# Altium project EX1.PrjPcb
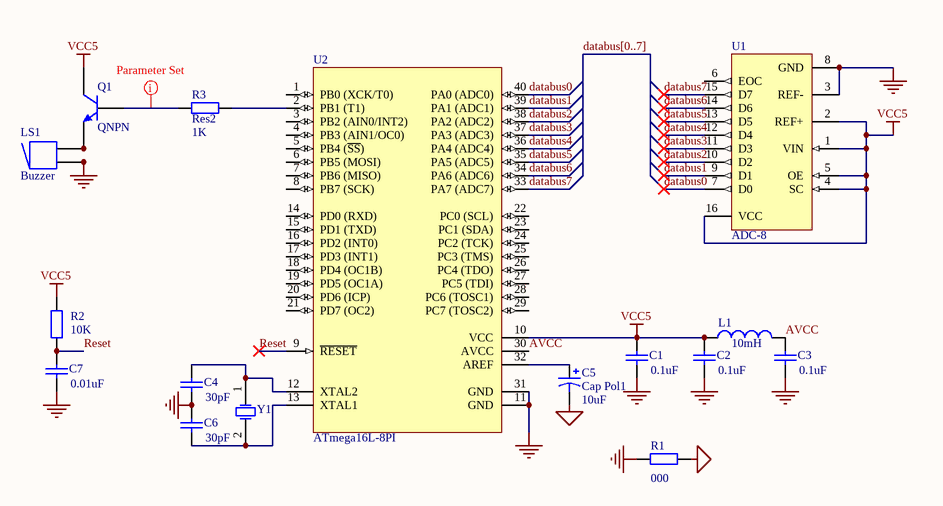
[diagram p0: EX1.SchDoc]
1 sheet, 16 parts. Net scope: global (net labels, ports and power ports of the same name join across sheets).
Board file: EX1.PcbDoc

## Sheet EX1.SchDoc: ex1
size A4; DocumentNumber: 1

### Parts
C1  value 0.1uF  [C0805]  (hidden comment: Cap)
C2  value 0.1uF  [C0805]  (hidden comment: Cap)
C3  value 0.1uF  [C0805]  (hidden comment: Cap)
C4  value 30pF  [C0805]  (hidden comment: Cap)
C5  Cap Pol1  value 10uF  [RB7.6-15]
C6  value 30pF  [C0805]  (hidden comment: Cap)
C7  value 0.01uF  [C0805]  (hidden comment: Cap)
L1  value 10mH  [C0805]  (hidden comment: Inductor)
LS1  Buzzer  [ABSM-1574]
Q1  QNPN  [SOT-23B_N]
R1  value 000  [6-0805_N]  (hidden comment: Res2)
R2  value 10K  [6-0805_N]  (hidden comment: Res2)
R3  Res2  value 1K  [6-0805_N]
U1  ADC-8  [SOT403-1_N]
U2  ATmega16L-8PI  [40P6]
Y1  XTAL  [R38]  (value not drawn)

### Nets
AGND: C5.2 R1.2
GND: C1.1 C2.1 C3.1 C4.1 C6.2 C7.2 LS1.1 LS1.1A R1.1 U1.3(REF-) U1.8(GND) U2.11(GND) U2.31(GND)
VCC5: C1.2 C2.2 L1.1 Q1.1(C) R2.2 U1.1(VIN) U1.2(REF+) U1.4(SC) U1.5(OE) U1.16(VCC) U2.10(VCC)
AVCC: C3.2 L1.2 U2.30(AVCC)
databus0: U1.7(D0) U2.40(PA0_(ADC0))
databus1: U1.9(D1) U2.39(PA1_(ADC1))
databus2: U1.10(D2) U2.38(PA2_(ADC2))
databus3: U1.11(D3) U2.37(PA3_(ADC3))
databus4: U1.12(D4) U2.36(PA4_(ADC4))
databus5: U1.13(D5) U2.35(PA5_(ADC5))
databus6: U1.14(D6) U2.34(PA6_(ADC6))
databus7: U1.15(D7) U2.33(PA7_(ADC7))
Reset: C7.1 R2.1 U2.9(~{RESET})
NetC4_2: C4.2 U2.12(XTAL2) Y1.1(OSC1)
NetC5_1: C5.1 U2.32(AREF)
NetC6_1: C6.1 U2.13(XTAL1) Y1.2(OSC2)
NetLS1_2: LS1.2 LS1.2A Q1.3(E)
NetQ1_2: Q1.2(B) R3.1
NetR3_2: R3.2 U2.2(PB1_(T1))

Not connected (* = marked no-connect by the designer): U1 6(EOC); U2 1(PB0_(XCK/T0)) 3(PB2_(AIN0/INT2)) 4(PB3_(AIN1/OC0)) 5(PB4_(~{SS})) 6(PB5_(MOSI)) 7(PB6_(MISO)) 8(PB7_(SCK)) 14(PD0_(RXD)) 15(PD1_(TXD)) 16(PD2_(INT0)) 17(PD3_(INT1)) 18(PD4_(OC1B)) 19(PD5_(OC1A)) 20(PD6_(ICP)) 21(PD7_(OC2)) 22(PC0_(SCL)) 23(PC1_(SDA)) 24(PC2_(TCK)) 25(PC3_(TMS)) 26(PC4_(TDO)) 27(PC5_(TDI)) 28(PC6_(TOSC1)) 29(PC7_(TOSC2))

### Buses and harness runs
bus databus[0..7]

### Layout directives
rule Routing Via Style [Pref Size = 50mil    Pref Hole Size = 28mil]: NetQ1_2

### Notes on the sheet
- Title
- Size:
- Date:
- A4
- Number:
- Time:
- Revision:
- Sheet
- of
- File:

### Library data of the parts
C1-C4 C6 C7 = Cap: Capacitor; Published: 8-Jun-2000; LatestRevisionDate: 17-Jul-2002; LatestRevisionNote: Re-released for DXP Platform.; PackageReference: RAD-0.3; Publisher: Altium Limited; PackageDescription: Radial Cap, Thru-Hole; 2 Leads; 0.3 in Pin Spacing
C5 = Cap Pol1: Polarized Capacitor (Radial); Published: 8-Jun-2000; LatestRevisionDate: 17-Jul-2002; LatestRevisionNote: Re-released for DXP Platform.; PackageReference: RB7.6-15; Publisher: Altium Limited; PackageDescription: Polarized Capacitor (Radial); 2 Leads
L1 = Inductor: Code_IEC: 1005; Published: 8-Jun-2000; LatestRevisionDate: 29-May-2009; LatestRevisionNote: IPC-7351 Footprint Added.; PackageReference: 0402-A; Publisher: Altium Limited; PackageDescription: Chip Inductor; Code_JEITA: 0402
LS1 = Buzzer: Magnetic Transducer Buzzer; Published: 24-Mar-1999; LatestRevisionDate: 17-Dec-2003; LatestRevisionNote: Schematic revised, PCB Footprint replaced.; DatasheetVersion: 17-Dec-2003; PackageReference: ABSM-1574; Publisher: Altium Limited; PackageDescription: Magnetic Transducer Buzzer; ComponentLink1Description: Manufacturer Link; ComponentLink1URL: http://www.megastar.com/linecard/buzzmode/index.php
Q1 = QNPN: NPN Bipolar Transistor; Published: 8-Jun-2000; LatestRevisionDate: 29-May-2009; LatestRevisionNote: IPC-7351 Footprint Added.; PackageVersion: Aug-1999; PackageReference: SOT-23B; Publisher: Altium Limited; PackageDescription: 3-Pin SOT-23 Package 0.95 mm Pitch, 2.4 mm Lead Span
R1-R3 = Res2: Resistor; Published: 8-Jun-2000; LatestRevisionDate: 17-Jul-2002; LatestRevisionNote: Re-released for DXP Platform.; PackageReference: AXIAL-0.4; Publisher: Altium Limited; PackageDescription: Axial Device, Thru-Hole; 2 Leads; 0.4 in Pin Spacing
U1 = ADC-8: Generic 8-Bit A/D Converter; Published: 8-Jun-2000; LatestRevisionDate: 29-May-2009; LatestRevisionNote: IPC-7351 Footprint Added.; PackageVersion: Mar-2002; PackageReference: SOT403-1; Publisher: Altium Limited; PackageDescription: 16-Pin Thin Small Outline Package 0.65 mm Pitch; Code_JEDEC: MO-153
U2 = ATmega16L-8PI: 8-Bit AVR Microcontroller with 16K Bytes of In-System Programmable Flash Memory; Published: 17-Sep-2003; LatestRevisionDate: 04-Mar-2005; LatestRevisionNote: Stylized 3D Model Added.; DatasheetVersion: 2466E-AVR-10/02; PackageVersion: Dec-1999; PackageReference: 40P6; Publisher: Altium Limited; PackageDescription: DIP; 40 Leads; Row Spacing 15.24 mm; Pitch 2.54 mm; ComponentLink1Description: Manufacturer Link; ComponentLink1URL: http://www.atmel.com; ComponentLink2Description: Datasheet; ComponentLink2URL: http://www.atmel.com/dyn/resources/prod_documents/doc2466.pdf
Y1 = XTAL: Crystal Oscillator; Published: 8-Jun-2000; LatestRevisionDate: 17-Jul-2002; LatestRevisionNote: Re-released for DXP Platform.; PackageReference: R38; Publisher: Altium Limited; PackageDescription: Crystal, Thru-Hole; 2 Leads; Body 3.1 x 8.2 mm (Dia.xH)